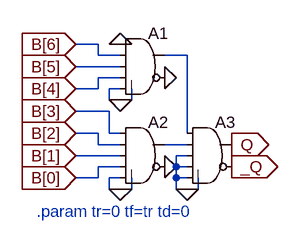
[diagram p0: schematic 7bit_and.asc]
7bit_and.asc, the LTspice schematic file:
Version 4
SHEET 1 880 680
WIRE 64 64 32 64
WIRE 64 80 64 64
WIRE 96 80 64 80
WIRE 192 80 160 80
WIRE 96 96 32 96
WIRE 96 112 64 112
WIRE 64 128 64 112
WIRE 64 128 32 128
WIRE 96 128 80 128
WIRE 80 144 80 128
WIRE 96 144 80 144
WIRE 112 144 112 128
WIRE 112 144 96 144
WIRE 80 160 32 160
WIRE 64 192 32 192
WIRE 80 192 80 160
WIRE 96 192 80 192
WIRE 192 192 192 80
WIRE 64 208 64 192
WIRE 96 208 64 208
WIRE 192 208 160 208
WIRE 96 224 32 224
WIRE 192 224 176 224
WIRE 96 240 64 240
WIRE 176 240 176 224
WIRE 192 240 176 240
WIRE 64 256 64 240
WIRE 64 256 32 256
WIRE 96 256 80 256
WIRE 176 256 176 240
WIRE 192 256 176 256
WIRE 80 272 80 256
WIRE 96 272 80 272
WIRE 112 272 112 256
WIRE 112 272 96 272
WIRE 176 272 176 256
WIRE 192 272 176 272
WIRE 208 272 208 256
WIRE 208 272 192 272
FLAG 160 112 0
FLAG 160 240 0
FLAG 192 272 0
FLAG 256 208 Q
IOPIN 256 208 Out
FLAG 256 240 _Q
IOPIN 256 240 Out
FLAG 32 64 B[6]
IOPIN 32 64 In
FLAG 32 96 B[5]
IOPIN 32 96 In
FLAG 32 128 B[4]
IOPIN 32 128 In
FLAG 96 272 0
FLAG 32 160 B[3]
IOPIN 32 160 In
FLAG 32 192 B[2]
IOPIN 32 192 In
FLAG 32 224 B[1]
IOPIN 32 224 In
FLAG 32 256 B[0]
IOPIN 32 256 In
FLAG 96 144 0
FLAG 96 64 0
SYMBOL Digital\\and 128 32 R0
SYMATTR InstName A1
SYMBOL Digital\\and 128 160 R0
SYMATTR InstName A2
SYMBOL Digital\\and 224 160 R0
SYMATTR InstName A3
TEXT -24 304 Left 2 ;.param tr=0 tf=tr td=0

The netlist it stands for:
* 7bit_and.asc
A1 0 B[6] B[5] B[4] 0 0 N001 0 AND
A2 B[3] B[2] B[1] B[0] 0 0 N002 0 AND
A3 N001 N002 0 0 0 _Q Q 0 AND
* .param tr=0 tf=tr td=0
.backanno
.end